# EAGLE design SDcard_final_rev02 (EAGLE 9.6.2)
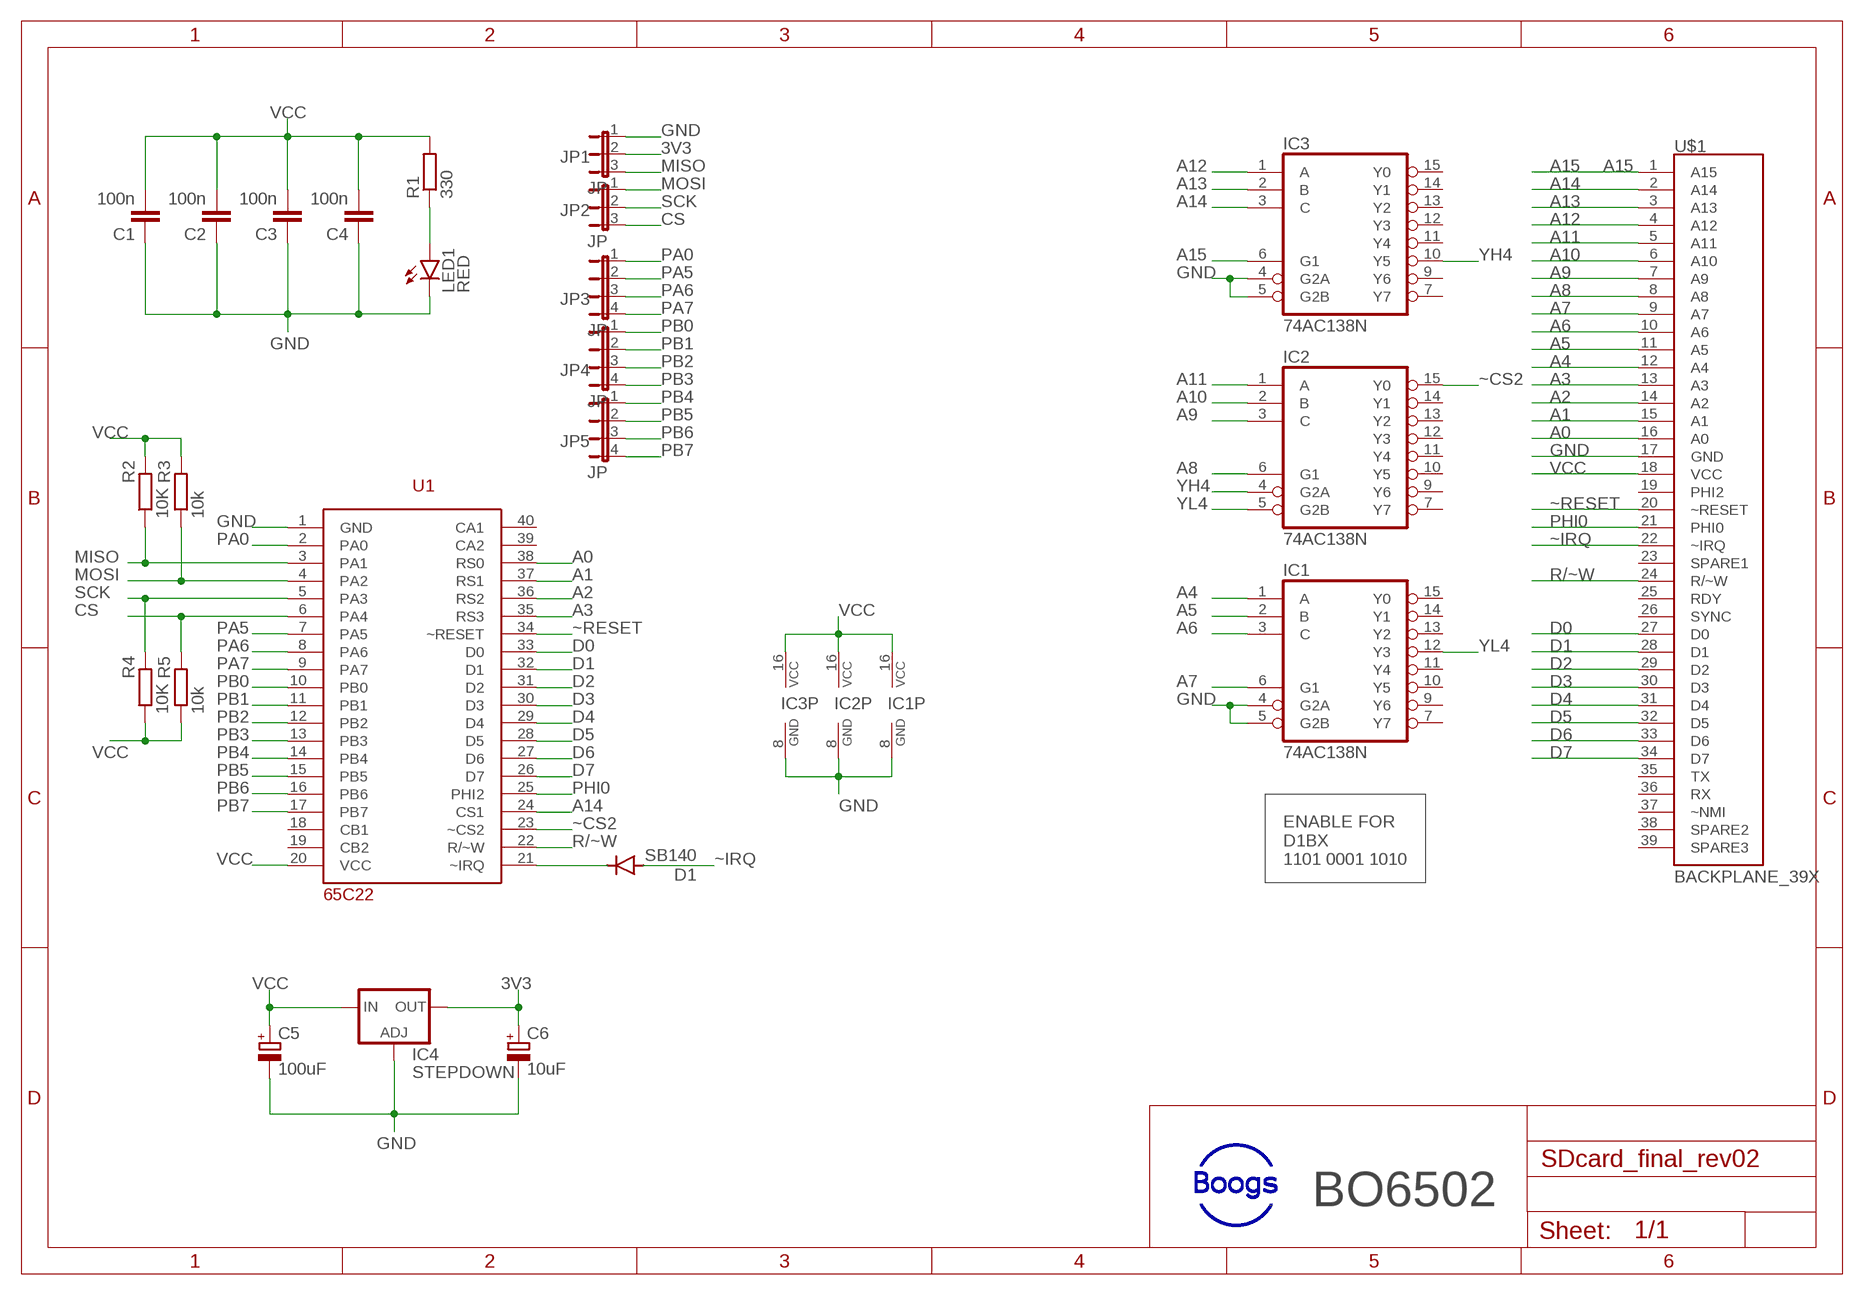
[diagram p0: schematic, sheet 1]

## Parts
C1  100n  C-EU025-025X050  [C025-025X050]
C2  100n  C-EU025-025X050  [C025-025X050]
C3  100n  C-EU025-025X050  [C025-025X050]
C4  100n  C-EU025-025X050  [C025-025X050]
C5  100uF  CPOL-EUB45181A  [B45181A]
C6  10uF  CPOL-EUB45181A  [B45181A]
D1  SB140  1N4004  [DO41-10]
IC1  74AC138N  [DIL16]
IC2  74AC138N  [DIL16]
IC3  74AC138N  [DIL16]
IC4  STEPDOWN  LM317TS  [317TS]
JP1  JP  JP2E  [JP2]
JP2  JP  JP2E  [JP2]
JP3  JP  JP4E  [JP4]
JP4  JP  JP4E  [JP4]
JP5  JP  JP4E  [JP4]
LED1  RED  LED5MM  [LED5MM]
R1  330  R-EU_0207/10  [0207/10]
R2  10K  R-EU_0207/10  [0207/10]
R3  10k  R-EU_0207/10  [0207/10]
R4  10K  R-EU_0207/10  [0207/10]
R5  10k  R-EU_0207/10  [0207/10]
U1  65C22  [DIL40]
U$1  BACKPLANE_39X  [BP_39X]

## Nets
3V3: C6.+ IC4.2(OUT) JP1.2
A0: U1.38(RS0) U$1.16(A0)
A1: U1.37(RS1) U$1.15(A1)
A2: U1.36(RS2) U$1.14(A2)
A3: U1.35(RS3) U$1.13(A3)
A4: IC1.1(A) U$1.12(A4)
A5: IC1.2(B) U$1.11(A5)
A6: IC1.3(C) U$1.10(A6)
A7: IC1.6(G1) U$1.9(A7)
A8: IC2.6(G1) U$1.8(A8)
A9: IC2.3(C) U$1.7(A9)
A10: IC2.2(B) U$1.6(A10)
A11: IC2.1(A) U$1.5(A11)
A12: IC3.1(A) U$1.4(A12)
A13: IC3.2(B) U$1.3(A13)
A14: IC3.3(C) U1.24(CS1) U$1.2(A14)
A15: IC3.6(G1) U$1.1(A15)
CS: JP2.3 R5.2 U1.6(PA4)
D0: U1.33(D0) U$1.27(D0)
D1: U1.32(D1) U$1.28(D1)
D2: U1.31(D2) U$1.29(D2)
D3: U1.30(D3) U$1.30(D3)
D4: U1.29(D4) U$1.31(D4)
D5: U1.28(D5) U$1.32(D5)
D6: U1.27(D6) U$1.33(D6)
D7: U1.26(D7) U$1.34(D7)
GND: C1.1 C2.1 C3.1 C4.1 C5.- C6.- IC1.4(G2A) IC1.5(G2B) IC1.8(GND) IC2.8(GND) IC3.4(G2A) IC3.5(G2B) IC3.8(GND) IC4.1(ADJ) JP1.1 LED1.K(C) U1.1(GND) U$1.17(GND)
MISO: JP1.3 R2.1 U1.3(PA1)
MOSI: JP2.1 R3.1 U1.4(PA2)
N$1: D1.C U1.21(~IRQ)
N$6: LED1.A R1.1
PA0: JP3.1 U1.2(PA0)
PA5: JP3.2 U1.7(PA5)
PA6: JP3.3 U1.8(PA6)
PA7: JP3.4 U1.9(PA7)
PB0: JP4.1 U1.10(PB0)
PB1: JP4.2 U1.11(PB1)
PB2: JP4.3 U1.12(PB2)
PB3: JP4.4 U1.13(PB3)
PB4: JP5.1 U1.14(PB4)
PB5: JP5.2 U1.15(PB5)
PB6: JP5.3 U1.16(PB6)
PB7: JP5.4 U1.17(PB7)
PHI0: U1.25(PHI2) U$1.21(PHI0)
R/~W: U1.22(R/~W) U$1.24(R/~W)
SCK: JP2.2 R4.2 U1.5(PA3)
VCC: C1.2 C2.2 C3.2 C4.2 C5.+ IC1.16(VCC) IC2.16(VCC) IC3.16(VCC) IC4.3(IN) R1.2 R2.2 R3.2 R4.1 R5.1 U1.20(VCC) U$1.18(VCC)
YH4: IC2.4(G2A) IC3.10(Y5)
YL4: IC1.12(Y3) IC2.5(G2B)
~CS2: IC2.15(Y0) U1.23(~CS2)
~IRQ: D1.A U$1.22(~IRQ)
~RESET: U1.34(~RESET) U$1.20(~RESET)
Unconnected: IC1.7(Y7) IC1.9(Y6) IC1.10(Y5) IC1.11(Y4) IC1.13(Y2) IC1.14(Y1) IC1.15(Y0) IC2.7(Y7) IC2.9(Y6) IC2.10(Y5) IC2.11(Y4) IC2.12(Y3) IC2.13(Y2) IC2.14(Y1) IC3.7(Y7) IC3.9(Y6) IC3.11(Y4) IC3.12(Y3) IC3.13(Y2) IC3.14(Y1) IC3.15(Y0) U1.18(CB1) U1.19(CB2) U1.39(CA2) U1.40(CA1) U$1.19(PHI2) U$1.23(SPARE1) U$1.25(RDY) U$1.26(SYNC) U$1.35(TX) U$1.36(RX) U$1.37(~NMI) U$1.38(SPARE2) U$1.39(SPARE3)

## Notes on the sheet
- ENABLE FOR
  D1BX
  1101 0001 1010
- BO6502

## Library data of the parts
C1-C4 = rcl:C-EU: CAPACITOR, European symbol; SPICEPREFIX: C
C5 C6 = rcl:CPOL-EU: POLARIZED CAPACITOR, European symbol; SPICEPREFIX: C
D1 = diode:1N4004: DIODE general purpose rectifier, 1 A
IC1-IC3 = 74xx-eu:74*138: 3-line to 8-line DECODER/DEMULTIPLEXER
IC4 = v-reg:LM317TS: VOLTAGE REGULATOR
JP1 JP2 = jumper:JP2E: JUMPER
JP3-JP5 = jumper:JP4E: JUMPER
LED1 = led:LED: LED OSRAM: - CHIPLED LG R971, LG N971, LY N971, LG Q971, LY Q971, LO R971, LY R971 LH N974, LH R974 LS Q976, LO Q976, LY Q976 LO Q996 - Hyper CHIPLED LW Q18S LB Q993, LB Q99A, LB R99A - SideLED LS A670, LO A670, LY A670, LG A670, LP A670 LB A673, LV A673, LT A673, LW A673 LH A674 LY A675 LS A676, LA A676, LO A676, LY A676, LW A676 LS A679, LY A679, LG A679 - Hyper Micro SIDELED® LS Y876, LA Y876, LO Y876, LY Y876 LT Y87S - SmartLED LW L88C, LW L88S LB L89C, LB L89S, LG L890 LS L89K, LO L89K, LY L89K LS L896, LA L896, LO L896, LY L896 - TOPLED LS T670, LO T670, LY T670, LG T670, LP T670 LSG T670, LSP T670, LSY T670, LOP T670, LYG T670 LG T671, LOG T671, LSG T671 LB T673, LV T673, LT T673, LW T673 LH T674 LS T676, LA T676, LO T676, LY T676, LB T676, LH T676, LSB T676, LW T676 LB T67C, LV T67C, LT T67C, LS T67K, LO T67K, LY T67K, LW E67C LS E67B, LA E67B, LO E67B, LY E67B, LB E67C, LV E67C, LT E67C LW T67C LS T679, LY T679, LG T679 LS T770, LO T770, LY T770, LG T770, LP T770 LB T773, LV T773, LT T773, LW T773 LH T774 LS E675, LA E675, LY E675, LS T675 LS T776, LA T776, LO T776, LY T776, LB T776 LHGB T686 LT T68C, LB T68C - Hyper Mini TOPLED® LB M676 - Mini TOPLED Santana® LG M470 LS M47K, LO M47K, LY M47K Source: http://www.osram.convergy.de LUXEON: - LUMILED® LXK2-PW12-R00, LXK2-PW12-S00, LXK2-PW14-U00, LXK2-PW14-V00 LXK2-PM12-R00, LXK2-PM12-S00, LXK2-PM14-U00 LXK2-PE12-Q00, LXK2-PE12-R00, LXK2-PE12-S00, LXK2-PE14-T00, LXK2-PE14-U00 LXK2-PB12-K00, LXK2-PB12-L00, LXK2-PB12-M00, LXK2-PB14-N00, LXK2-PB14-P00, LXK2-PB14-Q00 LXK2-PR12-L00, LXK2-PR12-M00, LXK2-PR14-Q00, LXK2-PR14-R00 LXK2-PD12-Q00, LXK2-PD12-R00, LXK2-PD12-S00 LXK2-PH12-R00, LXK2-PH12-S00 LXK2-PL12-P00, LXK2-PL12-Q00, LXK2-PL12-R00 Source: www.luxeon.com KINGBRIGHT: KA-3528ASYC Source: www.kingbright.com
R1-R5 = rcl:R-EU_: RESISTOR, European symbol; SPICEPREFIX: R
U1 = 65xx_family:65C22
U$1 = 65xx_family:BACKPLANE_39X; A15: A15

## Board
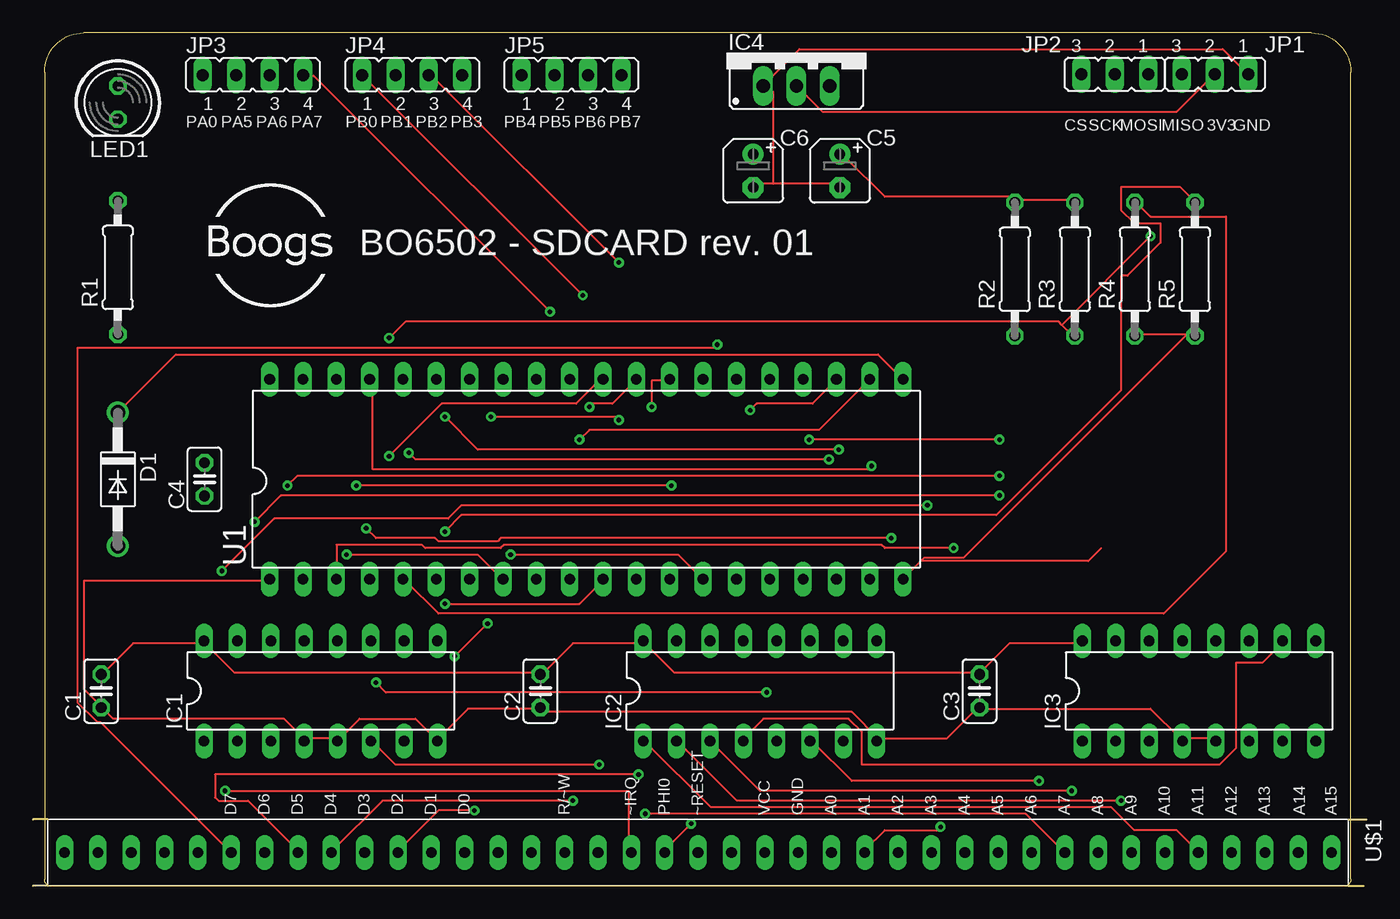
[diagram p1: board, top side]
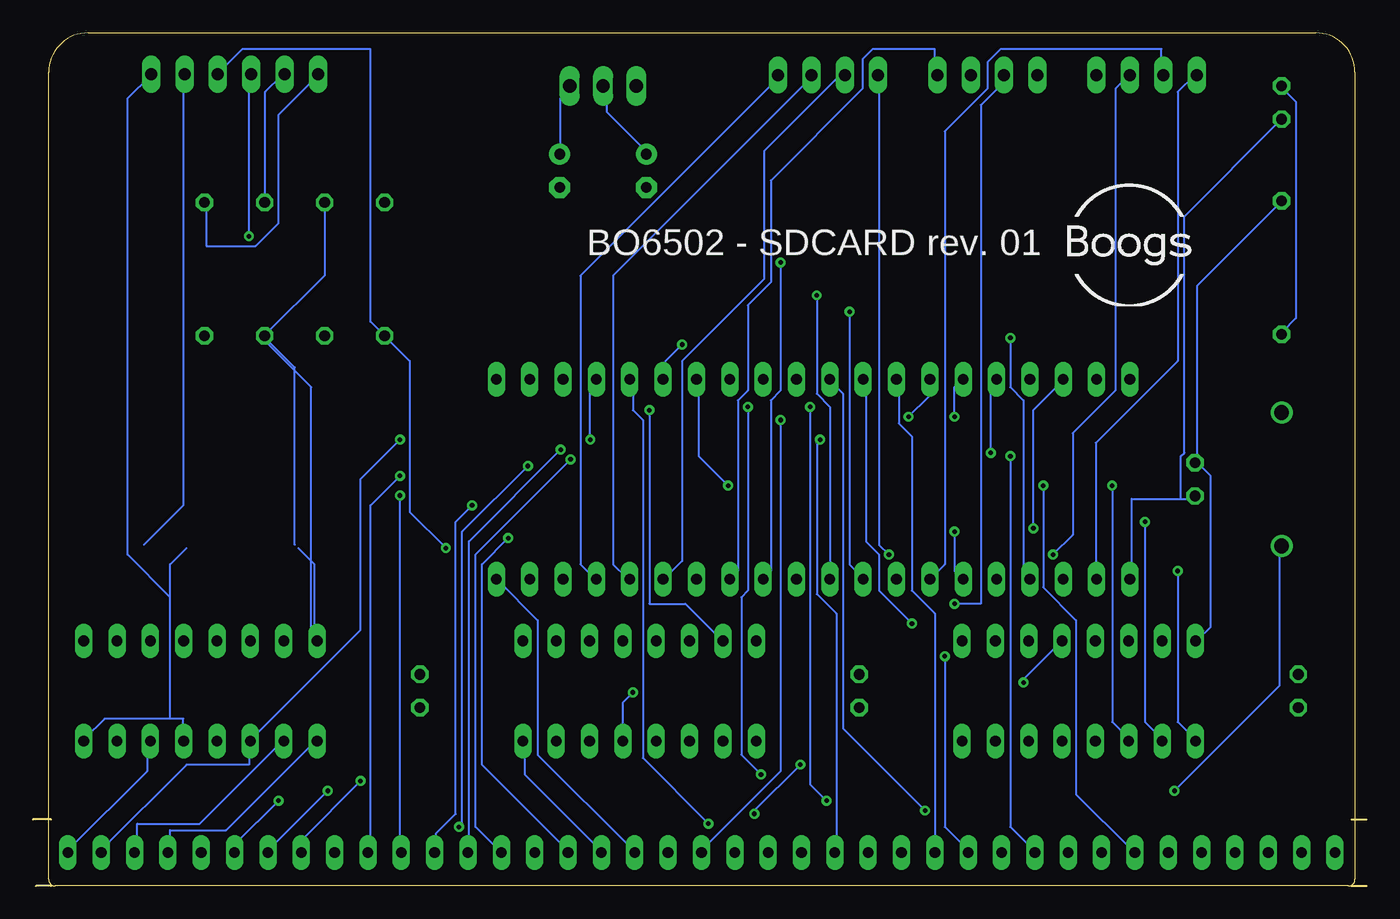
[diagram p2: board, bottom side, seen from below]

Size 101.6 x 65 mm. Coordinates in mm from the lower left corner, seen from the top.
Outline: 1.14,5.08 0,5.08
Outline: 1.14,0 0,0
Outline: 100.2,5.08 101.6,5.08
Outline: 100.2,0 101.35,0
Outline: 1.39,0 99.89,0 arc90 100.39,0.5 100.39,62 arc90 97.39,65 3.89,65 arc90 0.89,62 0.89,0.5 arc90 1.39,0
Copper layers (1*16): Top 0.035mm / dielectric 1.5mm / Bottom 0.035mm
Design rules "default *": minimum track width 6mil, minimum drill 0.35mm, track to track 10mil, track to pad 10mil, pad to pad 10mil, via to via 10mil, smd to smd 6mil, copper to edge 40mil, drill to drill 6mil, minimum pad ring 10mil, minimum via ring 8mil, stop-mask expansion 4mil, vias tented up to drill 15mil, thermal gap 10mil

### Footprints (pad centres in the part's own frame; a part is rotated, then mirrored left to right if it is on the bottom)
C025-025X050 = drill 0.813 octagon: 1 -1.27,0; 2 1.27,0
B45181A = drill 0.813 pad 1.6: + -1.27,0 | drill 0.813 pad 1.6 octagon: - 1.27,0
DO41-10 = drill 1.118: A 5.08,0; C -5.08,0
DIL16 = drill 0.813 long: 1 -8.89,-3.81; 2 -6.35,-3.81; 3 -3.81,-3.81; 4 -1.27,-3.81; 5 1.27,-3.81; 6 3.81,-3.81; 7 6.35,-3.81; 8 8.89,-3.81; 9 8.89,3.81; 10 6.35,3.81; 11 3.81,3.81; 12 1.27,3.81; 13 -1.27,3.81; 14 -3.81,3.81; 15 -6.35,3.81; 16 -8.89,3.81
317TS = drill 1.016 long: 1 -2.54,-2.54; 2 0,-2.54; 3 2.54,-2.54
JP2 = drill 0.914 long: 1 -2.54,0; 2 0,0; 3 2.54,0
JP4 = drill 0.914 long: 1 -3.81,0; 2 -1.27,0; 3 1.27,0; 4 3.81,0
LED5MM = drill 0.813 octagon: A -1.27,0; K 1.27,0
0207/10 = drill 0.813 octagon: 1 -5.08,0; 2 5.08,0
DIL40 = drill 0.813 long: 1 -24.13,-7.62; 2 -21.59,-7.62; 3 -19.05,-7.62; 4 -16.51,-7.62; 5 -13.97,-7.62; 6 -11.43,-7.62; 7 -8.89,-7.62; 8 -6.35,-7.62; 9 -3.81,-7.62; 10 -1.27,-7.62; 11 1.27,-7.62; 12 3.81,-7.62; 13 6.35,-7.62; 14 8.89,-7.62; 15 11.43,-7.62; 16 13.97,-7.62; 17 16.51,-7.62; 18 19.05,-7.62; 19 21.59,-7.62; 20 24.13,-7.62; 21 24.13,7.62; 22 21.59,7.62; 23 19.05,7.62; 24 16.51,7.62; 25 13.97,7.62; 26 11.43,7.62; 27 8.89,7.62; 28 6.35,7.62; 29 3.81,7.62; 30 1.27,7.62; 31 -1.27,7.62; 32 -3.81,7.62; 33 -6.35,7.62; 34 -8.89,7.62; 35 -11.43,7.62; 36 -13.97,7.62; 37 -16.51,7.62; 38 -19.05,7.62; 39 -21.59,7.62; 40 -24.13,7.62
BP_39X = drill 0.813 long: 1 1.27,59.69; 2 1.27,57.15; 3 1.27,54.61; 4 1.27,52.07; 5 1.27,49.53; 6 1.27,46.99; 7 1.27,44.45; 8 1.27,41.91; 9 1.27,39.37; 10 1.27,36.83; 11 1.27,34.29; 12 1.27,31.75; 13 1.27,29.21; 14 1.27,26.67; 15 1.27,24.13; 16 1.27,21.59; 17 1.27,19.05; 18 1.27,16.51; 19 1.27,13.97; 20 1.27,11.43; 21 1.27,8.89; 22 1.27,6.35; 23 1.27,3.81; 24 1.27,1.27; 25 1.27,-1.27; 26 1.27,-3.81; 27 1.27,-6.35; 28 1.27,-8.89; 29 1.27,-11.43; 30 1.27,-13.97; 31 1.27,-16.51; 32 1.27,-19.05; 33 1.27,-21.59; 34 1.27,-24.13; 35 1.27,-26.67; 36 1.27,-29.21; 37 1.27,-31.75; 38 1.27,-34.29; 39 1.27,-36.83

### Placement (x,y rotation side)
C1  5.21,14.86 90 top
C2  38.66,14.86 90 top
C3  72.11,14.86 90 top
C4  13.08,30.99 90 top
C5  61.47,54.48 270 top
C6  54.86,54.48 270 top
D1  6.48,30.99 270 top
IC1  21.93,14.86 0 top
IC2  55.38,14.86 0 top
IC3  88.84,14.86 0 top
IC4  58.17,63.5 0 top
JP1  90.04,61.85 180 top
JP2  82.42,61.85 180 top
JP3  16.76,61.79 0 top
JP4  28.89,61.79 0 top
JP5  41.02,61.79 0 top
LED1  6.48,59.69 270 top
R1  6.48,47.12 90 top
R2  74.8,46.99 90 top
R3  79.38,46.99 90 top
R4  83.95,46.99 90 top
R5  88.52,46.99 90 top
U1  42.16,30.99 0 top
U$1  39.24,3.81 270 top

### Tracks (layer width: path | path; a pad name or v marks a point on that pad's centre or on a via)
3V3
  Top 0.152: JP1.2 89.89,61.75 87.14,59 60.14,59 58.39,60.75 IC4.2
  Bottom 0.152: 93.14,26 90.14,29 90.14,61.75 JP1.2 | C6.+ 54.89,56 57.89,59 57.89,60.5 IC4.2
A0  (via drill 0.35)
  Top 0.152: v25.39,27.25 26.14,26.5 30.64,26.5 30.89,26.25 35.39,26.25 35.64,26.5 v65.39,26.5
  Bottom 0.152: v25.39,27.25 25.39,36.25 23.14,38.5 U1.38 | v65.39,26.5 67.39,24.5 67.39,9.25 60.89,2.75 U$1.16
A1  (via drill 0.35)
  Top 0.152: v63.89,32 63.64,31.75 25.89,31.75 25.89,38.5 U1.37 | v69.14,4.5 68.89,4.25 64.89,4.25 63.39,2.75 U$1.15
  Bottom 0.152: v63.89,32 68.89,27 68.89,4.75 v69.14,4.5
A2  (via drill 0.35)
  Top 0.152: v28.64,33 29.14,32.5 v60.64,32.5
  Bottom 0.152: v28.64,33 28.64,38.25 28.39,38.5 U1.36 | v60.64,32.5 67.89,25.25 67.89,4.5 66.14,2.75 U$1.14
A3  (via drill 0.35)
  Top 0.152: v31.39,35.75 33.89,33.25 v61.39,33.25
  Bottom 0.152: v31.39,35.75 31.39,38 30.89,38.5 U1.35 | v61.39,33.25 68.39,26.25 68.39,2.75 U$1.13
A4  (via drill 0.35)
  Top 0.152: v14.39,24 18.39,28 31.64,28 32.64,29 v68.14,29
  Bottom 0.152: v14.39,24 14.39,12.5 13.14,11.25 IC1.1 | v68.14,29 69.39,27.75 69.39,5.5 70.89,4 70.89,2.75 U$1.12
A5  (via drill 0.35)
  Top 0.152: v16.89,27.75 18.89,29.75 v73.64,29.75
  Bottom 0.152: v16.89,27.75 16.89,12.5 15.64,11.25 IC1.2 | v73.64,29.75 73.64,2.75 U$1.11
A6  (via drill 0.35)
  Top 0.152: v19.39,30.5 20.14,31.25 v73.64,31.25
  Bottom 0.152: v19.39,30.5 19.39,12.5 18.14,11.25 IC1.3 | v73.64,31.25 75.89,29 75.89,2.75 U$1.10
A7  (via drill 0.35)
  Top 0.152: v43.14,9.25 27.64,9.25 25.89,11 IC1.6 | v46.64,5.5 75.64,5.5 78.39,2.75 U$1.9
  Bottom 0.152: v43.14,9.25 46.64,5.75 v46.64,5.5
A8  (via drill 0.35)
  Top 0.152: v76.64,8 62.39,8 59.39,11 IC2.6
  Bottom 0.152: v76.64,8 81.14,3.5 81.14,2.75 U$1.8
A9  (via drill 0.35)
  Top 0.152: v79.14,7.25 55.39,7.25 51.64,11 IC2.3
  Bottom 0.152: v79.14,7.25 83.64,2.75 U$1.7
A10  (via drill 0.35)
  Top 0.152: v82.89,6.5 53.64,6.5 49.14,11 IC2.2
  Bottom 0.152: v82.89,6.5 86.14,3.25 86.14,2.75 U$1.6
A11
  Top 0.152: IC2.1 46.64,11 51.64,6 82.14,6 83.89,4.25 87.14,4.25 88.64,2.75 U$1.5
A12
  Bottom 0.152: IC3.1 80.14,11 86.89,4.25 91.14,4.25 91.14,2.75 U$1.4
A13
  Bottom 0.152: IC3.2 82.64,11 88.89,4.75 93.64,4.75 93.64,2.75 U$1.3
A14  (via drill 0.35)
  Top 0.152: v73.64,34 v59.14,34
  Bottom 0.152: v59.14,34 59.14,38.25 58.89,38.5 U1.24 | v73.64,34 76.64,31 76.64,19.5 84.89,11.25 IC3.3 85.14,11 85.14,9.25 89.89,9.25 96.39,2.75 U$1.2
A15
  Bottom 0.152: U$1.1 98.89,2.75 92.89,8.75 92.89,11 IC3.6
CS  (via drill 0.35)
  Top 0.152: v31.39,27 32.64,28.25 73.39,28.25 82.89,37.75 82.89,46.5 83.39,46.5 85.89,49 85.89,50.5 83.89,50.5 82.89,51.5 82.89,53.25 87.39,53.25 88.39,52.25 R5.2
  Bottom 0.152: v31.39,27 31.39,24 30.89,23.5 U1.6 | JP2.3 79.89,61.75 82.89,58.75 82.89,50.5 84.64,48.75 88.39,48.75 88.39,52 R5.2
D0
  Bottom 0.152: U$1.27 32.89,2.75 32.89,20.75 34.64,22.5 34.64,34.25 35.64,35.25 35.64,38.5 U1.33
D1  (via drill 0.35)
  Top 0.152: v34.64,20 v32.14,17.5
  Bottom 0.152: v32.14,17.5 32.14,4.5 30.39,2.75 U$1.28 | v34.64,20 37.14,22.5 37.14,25.25 38.14,26.25 38.14,38.5 U1.32
D2  (via drill 0.35)
  Top 0.152: v33.64,5.75 30.89,5.75 27.89,2.75 U$1.29
  Bottom 0.152: v33.64,5.75 39.89,12 39.89,37.5 40.89,38.5 U1.31
D3  (via drill 0.35)
  Top 0.152: v27.14,32.75 31.14,36.75 41.39,36.75 43.14,38.5 43.39,38.5 U1.30
  Bottom 0.152: v27.14,32.75 27.14,4.5 25.39,2.75 U$1.30
D4  (via drill 0.35)
  Top 0.152: v41.14,6.5 26.64,6.5 22.89,2.75 U$1.31 | v42.39,36.5 42.64,36.75 44.14,36.75 45.89,38.5 U1.29
  Bottom 0.152: v41.14,6.5 42.39,7.75 v42.39,36.5
D5  (via drill 0.35)
  Top 0.152: v46.14,8.5 13.89,8.5 13.89,6.75 14.14,6.5 16.39,6.5 20.14,2.75 U$1.32 | v47.14,36.5 47.14,38.5 48.39,38.5 U1.28
  Bottom 0.152: v46.14,8.5 47.64,10 47.64,22 47.14,22.5 v47.14,36.5
D6  (via drill 0.35)
  Top 0.152: v48.64,30.5 v24.64,30.5
  Bottom 0.152: v24.64,30.5 24.64,22.75 22.14,20.25 22.14,7 17.89,2.75 U$1.33 | v48.64,30.5 50.89,32.75 50.89,38.5 U1.27
D7  (via drill 0.35)
  Top 0.152: v52.14,41.25 51.89,41 3.39,41 3.39,14 4.89,12.5 5.14,12.5 14.89,2.75 U$1.34
  Bottom 0.152: v52.14,41.25 53.39,40 53.39,38.75 U1.26
GND
  Top 0.152: U1.1 17.89,23.25 3.89,23.25 3.89,15 5.14,13.75 C1.1 5.39,13.5 6.14,12.75 19.14,12.75 20.64,11.25 IC1.4 20.89,11.25 23.14,11.25 IC1.5 23.39,11.25 24.89,12.75 29.14,12.75 30.64,11.25 IC1.8 30.89,11.25 33.14,13.5 38.64,13.5 C2.1 38.89,13.5 39.14,13.25 62.39,13.25 64.39,11.25 | JP1.1 92.39,62 90.64,63.75 58.39,63.75 55.64,61 IC4.1 55.89,60.5 56.39,60.5 56.39,53.5 | IC3.5 89.89,11.25 87.64,11.25 IC3.4 87.39,11.25 85.14,13.5 72.14,13.5 C3.1 71.89,13.5 69.64,11.25 64.39,11.25 | 64.39,11.25 IC2.8 | 56.39,53.5 61.39,53.5 C5.- | 56.39,53.5 54.89,53.5 C6.-
  Bottom 0.152: 14.14,29.5 17.89,29.5 17.89,23.5 U1.1 | 14.14,29.5 13.14,29.5 C4.1 | 14.14,29.5 14.14,32.75 13.89,33 13.89,51 6.64,58.25 LED1.K | 91.14,12.75 90.14,12.75 90.14,11.25 IC3.5 | 91.14,12.75 96.14,12.75 97.64,11.25 IC3.8 | U$1.17 58.39,2.75 64.14,8.5 64.14,11 IC2.8 | 89.89,25.75 91.14,24.5 91.14,22 | 91.14,12.75 91.14,22 | 91.14,22 94.39,25.25 94.39,60 92.64,61.75 JP1.1
MISO  (via drill 0.35)
  Top 0.152: v70.14,25.75 64.89,25.75 64.64,26 35.89,26 35.64,25.75 29.89,25.75 29.64,26 23.14,26 23.14,23.5 U1.3
  Bottom 0.152: v70.14,25.75 72.89,28.5 72.89,40 74.64,41.75 R2.1 74.89,42 75.89,43 75.89,63.75 85.64,63.75 87.39,62 JP1.3
MOSI  (via drill 0.35)
  Top 0.152: v27.14,41.75 28.39,43 78.14,43 78.39,42.75 | 78.39,42.75 79.14,42 R3.1 | 78.39,42.75 v85.14,49.5
  Bottom 0.152: v27.14,41.75 27.14,38 26.14,37 26.14,23.75 25.89,23.5 U1.4 | v85.14,49.5 85.14,61.75 JP2.1
N$1
  Top 0.152: U1.21 66.14,38.75 64.39,40.5 10.89,40.5 6.64,36.25 D1.C
N$6
  Bottom 0.152: R1.1 6.39,42.25 5.39,43.25 5.39,59.75 6.39,60.75 LED1.A
PA0
  Bottom 0.152: U1.2 20.64,23.5 20.64,33.75 14.39,40 14.39,60.5 13.14,61.75 JP3.1
PA5
  Bottom 0.152: U1.7 33.14,23.5 32.14,24.5 32.14,57.5 28.89,60.75 28.89,62.75 27.89,63.75 15.64,63.75 15.64,62 JP3.2
PA6  (via drill 0.35)
  Top 0.152: v23.89,25.25 33.89,25.25 35.64,23.5 U1.8
  Bottom 0.152: v23.89,25.25 22.39,26.75 22.39,34.5 19.14,37.75 19.14,60.75 18.14,61.75 JP3.3
PA7  (via drill 0.35)
  Top 0.152: v39.39,43.75 21.39,61.75 20.64,61.75 JP3.4
  Bottom 0.152: v39.39,43.75 39.39,24.5 38.39,23.5 U1.9
PB0  (via drill 0.35)
  Top 0.152: v41.89,45 25.14,61.75 JP4.1
  Bottom 0.152: v41.89,45 41.89,37.5 40.89,36.5 40.89,23.5 U1.10
PB1  (via drill 0.35)
  Top 0.152: v31.39,21.5 41.64,21.5 43.39,23.25 U1.11
  Bottom 0.152: v31.39,21.5 29.39,21.5 29.39,59.5 27.64,61.25 27.64,61.75 JP4.2
PB2  (via drill 0.35)
  Top 0.152: v44.64,47.5 30.39,61.75 JP4.3
  Bottom 0.152: v44.64,47.5 44.64,37.75 45.39,37 45.39,24 45.89,23.5 U1.12
PB3
  Bottom 0.152: U1.13 48.39,23.5 47.89,24 47.89,37 47.14,37.75 47.14,44.25 45.39,46 45.39,53.75 38.39,60.75 38.39,63 37.64,63.75 32.89,63.75 32.89,62 JP4.4
PB4  (via drill 0.35)
  Top 0.152: v36.39,25.25 49.14,25.25 50.89,23.5 U1.14
  Bottom 0.152: v36.39,25.25 37.14,26 37.14,61.75 JP5.1
PB5
  Bottom 0.152: U1.15 53.39,23.5 52.14,24.75 52.14,40 45.89,46.25 45.89,56 39.89,62 JP5.2
PB6
  Bottom 0.152: U1.16 56.39,23.5 57.39,24.5 57.39,46.5 42.39,61.5 JP5.3
PB7
  Bottom 0.152: U1.17 58.89,23.5 59.89,24.5 59.89,46.5 44.89,61.5 JP5.4
PHI0  (via drill 0.35)
  Top 0.152: v50.14,4.75 48.14,2.75 U$1.21
  Bottom 0.152: v50.14,4.75 55.14,9.75 55.14,35.5 55.89,36.25 55.89,38.5 U1.25
R/~W  (via drill 0.35)
  Top 0.152: v41.64,34 42.39,34.75 59.89,34.75 63.64,38.5 U1.22
  Bottom 0.152: v41.64,34 41.89,33.75 41.89,22.25 40.39,20.75 40.39,2.75 U$1.24
SCK
  Top 0.152: U1.5 28.39,23.25 30.89,20.75 86.14,20.75 90.89,25.5 90.89,51 85.14,51 84.14,52 R4.2
  Bottom 0.152: JP2.2 82.64,61.75 83.89,60.5 83.89,52.25 R4.2
VCC
  Top 0.152: 87.89,42 88.39,42 R5.1 87.89,42 | 87.89,42 84.14,42 R4.1 | R3.2 79.14,52.25 74.89,52.25 R2.2 74.39,52.5 64.89,52.5 61.89,55.5 C5.+ | C1.2 5.39,16.25 7.64,18.5 12.89,18.5 IC1.16 13.14,18.5 15.39,16.25 38.64,16.25 C2.2 38.89,16.25 41.14,18.5 46.39,18.5 IC2.16 46.64,18.5 48.89,16.25 71.89,16.25 C3.2 72.14,16.25 74.39,18.5 79.89,18.5 IC3.16 | 67.64,24.75 67.39,24.5 66.39,23.5 U1.20 | 67.64,24.75 80.39,24.75 81.39,25.75 | 67.64,24.75 67.89,25 70.89,25 87.89,42
  Bottom 0.152: 79.89,18.5 IC3.16 | 66.39,23.25 U1.20 66.14,23.25 63.14,20.25 63.14,10 55.89,2.75 U$1.18 | R4.1 83.89,42 79.39,46.5 79.39,52 R3.2 | IC1.16 12.89,18.75 11.89,19.75 11.89,31.25 12.89,32.25 C4.2 12.89,32.5 12.89,45.75 6.64,52 R1.2 | 81.39,25.75 80.14,24.5 80.14,18.75 IC3.16 | 81.64,26 81.64,39.5 83.89,41.75 R4.1 | IC4.3 60.89,60.5 61.39,60 61.39,56 C5.+ | R4.1 83.89,41.5 80.39,38 80.39,19 IC3.16
YH4
  Top 0.152: IC2.4 54.14,11.25 55.64,12.75 62.14,12.75 63.14,11.75 63.14,9.25 90.39,9.25 91.64,10.5 91.64,17 93.64,17 95.14,18.5 IC3.10
YL4  (via drill 0.35)
  Top 0.152: v26.14,15.5 26.89,14.75 v55.89,14.75
  Bottom 0.152: v26.14,15.5 26.14,15.75 23.39,18.5 IC1.12 | v55.89,14.75 56.64,14 56.64,11.25 IC2.5
~CS2  (via drill 0.35)
  Top 0.152: v54.64,36.25 55.14,36.75 59.39,36.75 61.14,38.5 U1.23
  Bottom 0.152: v54.64,36.25 54.64,21.5 51.89,21.5 49.14,18.75 IC2.15
~IRQ  (via drill 0.35)
  Top 0.152: v14.64,7.25 45.39,7.25 45.39,2.75 U$1.22
  Bottom 0.152: v14.64,7.25 6.64,15.25 6.64,25.75 D1.A
~RESET  (via drill 0.35)
  Top 0.152: v44.64,35.5 44.39,35.75 v34.89,35.75
  Bottom 0.152: v44.64,35.5 44.64,8.75 50.64,2.75 U$1.20 | v34.89,35.75 33.39,37.25 33.39,38.5 U1.34

### Text on the board
tNames: PA0 | PA5 | PA6 | PA7 | PB0 | PB1 | PB2 | PB3 | PB4 | PB5 | PB6 | PB7 | CS | SCK | MOSI | MISO | 3V3 | GND | BO6502 - SDCARD rev. 01 | D7 | D6 | D5 | D4 | D3 | D2 | D1 | D0 | R/~W | ~IRQ | PHI0 | ~RESET | VCC | GND | A0 | A1 | A2 | A3 | A4 | A5 | A6 | A7 | A8 | A9 | A10 | A11 | A12 | A13 | A14 | A15
bNames: BO6502 - SDCARD rev. 01